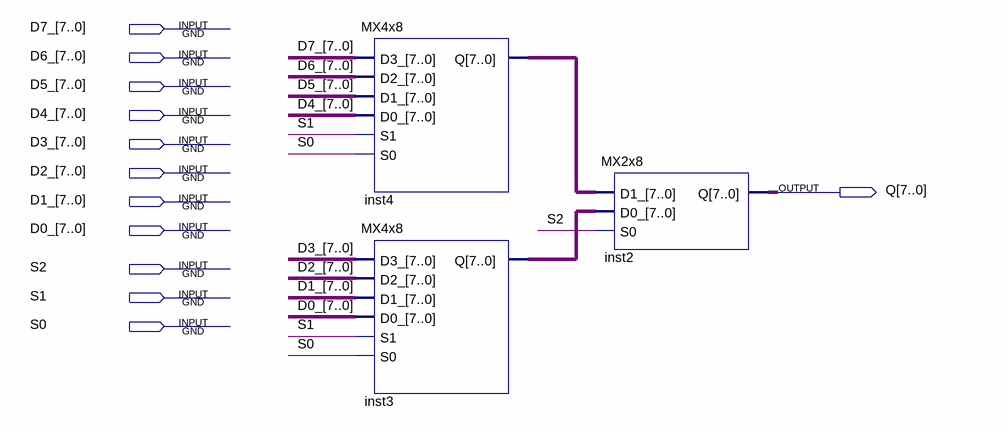
[diagram p0: schematic sheet]
// Quartus schematic MX8x8.bdf as structural Verilog: 3 symbols, 12 pins
module MX8x8 (
  input  [7:0] D7_,
  input  [7:0] D6_,
  input  [7:0] D5_,
  input  [7:0] D4_,
  input  [7:0] D3_,
  input  [7:0] D2_,
  input  [7:0] D1_,
  input  [7:0] D0_,
  input  S2,
  input  S1,
  input  S0,
  output [7:0] Q
);

  wire [7:0] inst3_q, inst4_q;

  MX4x8 inst4 (.D3_(D7_), .D2_(D6_), .D1_(D5_), .D0_(D4_), .S1(S1), .S0(S0), .Q(inst4_q));
  MX4x8 inst3 (.D3_(D3_), .D2_(D2_), .D1_(D1_), .D0_(D0_), .S1(S1), .S0(S0), .Q(inst3_q));
  MX2x8 inst2 (.D1_(inst4_q), .D0_(inst3_q), .S0(S2), .Q(Q));
endmodule
